# EAGLE design LED Controller 2011 (EAGLE 5.11)
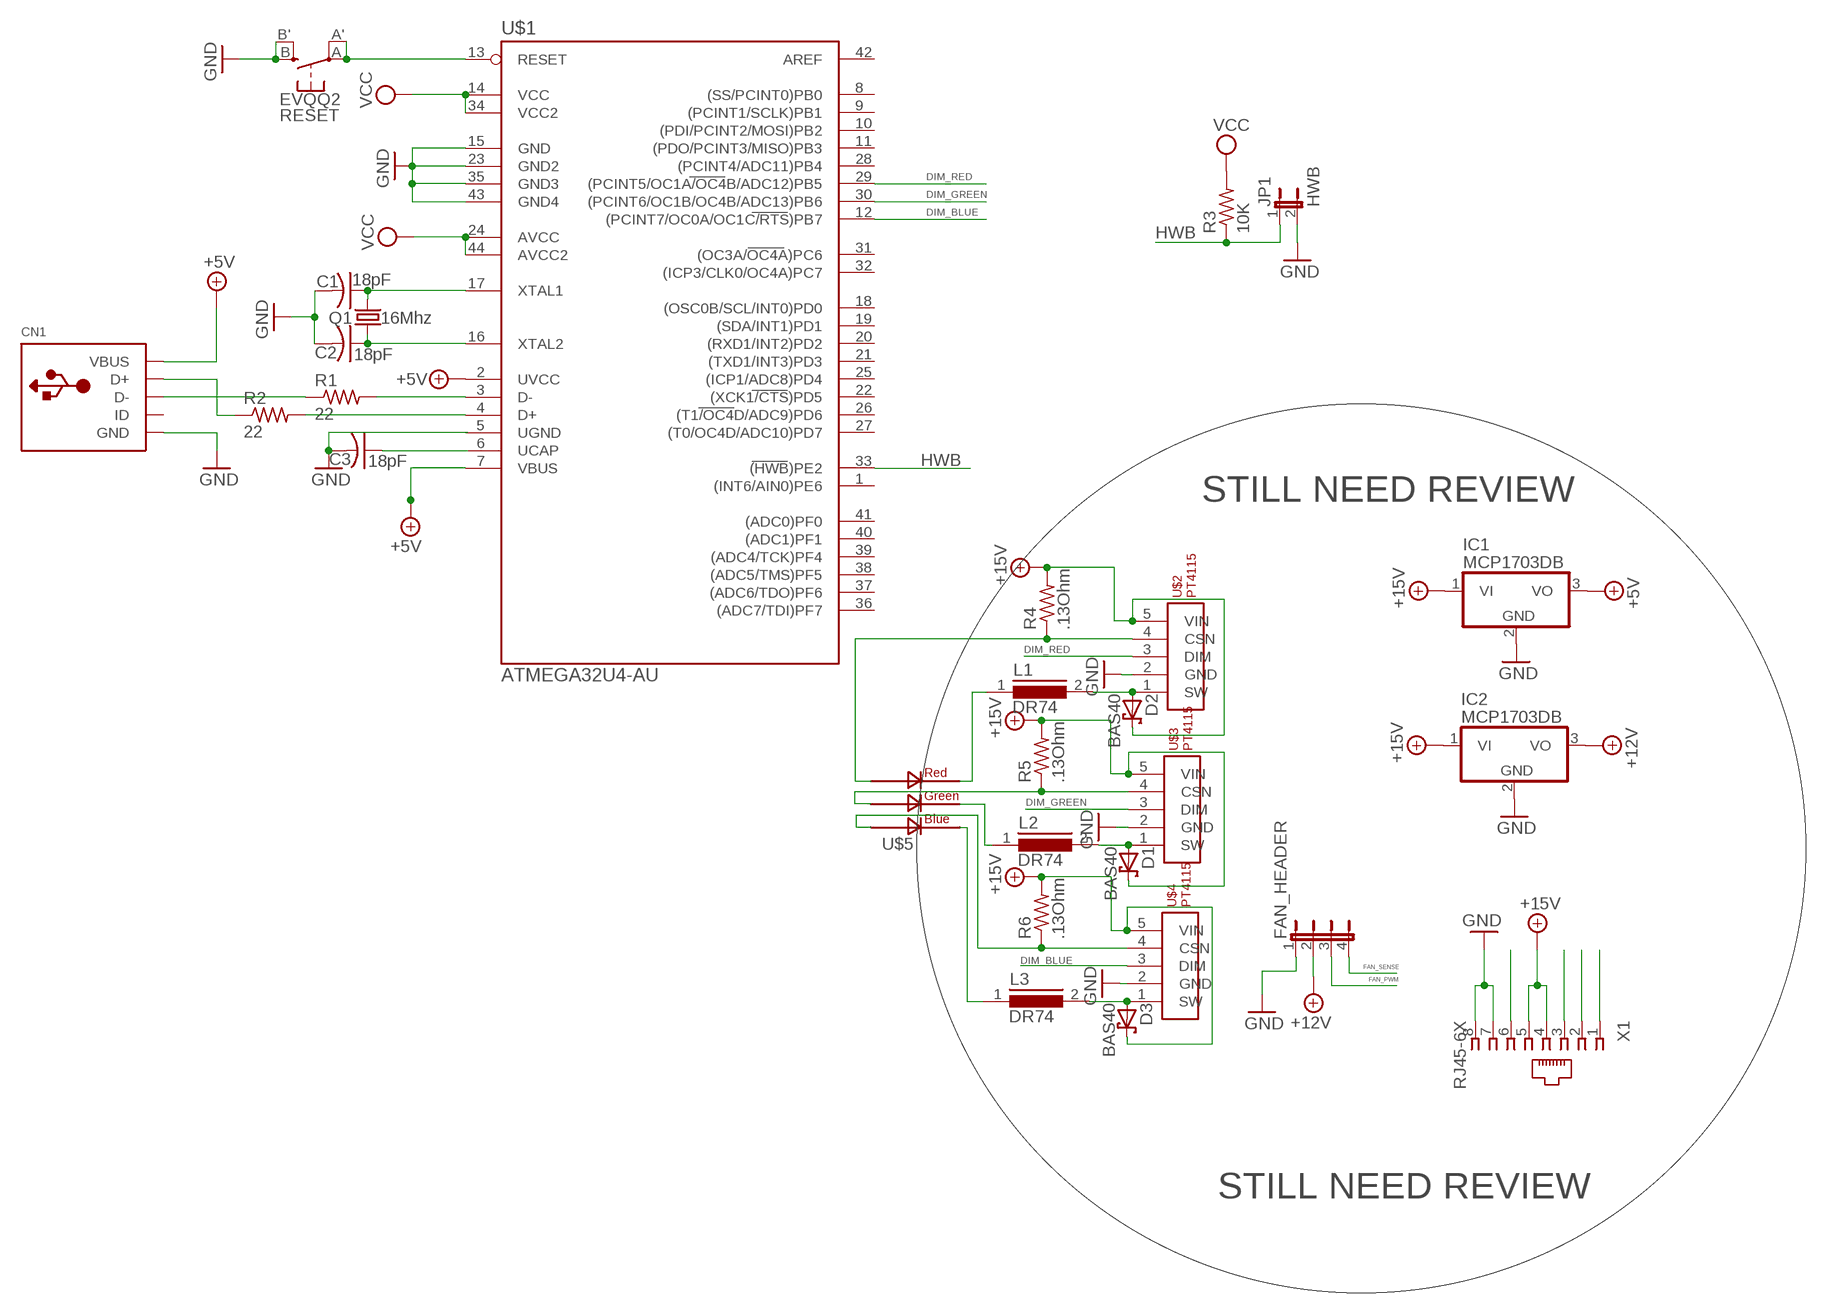
[diagram p0: schematic, sheet 1]

## Parts
C1  18pF  C-USC0805K  [C0805K]
C2  18pF  C-USC0805K  [C0805K]
C3  18pF  C-USC0805K  [C0805K]
CN1  USBMINIB  [USB-MINIB]
D1  BAS40  [SOT23]
D2  BAS40  [SOT23]
D3  BAS40  [SOT23]
FAN_HEADER  JP4E  [JP4]
IC1  MCP1703DB  [SOT223]
IC2  MCP1703DB  [SOT223]
JP1  HWB  JP1E  [JP1]
L1  DR74  [DR74]
L2  DR74  [DR74]
L3  DR74  [DR74]
Q1  16Mhz  CRYSTALHC49S  [HC49/S]
R1  22  R-US_R0805  [R0805]
R2  22  R-US_R0805  [R0805]
R3  10K  R-US_R0805  [R0805]
R4  .13Ohm  R-US_R0805  [R0805]
R5  .13Ohm  R-US_R0805  [R0805]
R6  .13Ohm  R-US_R0805  [R0805]
RESET  EVQQ2  [EVQ-Q2]
U$1  ATMEGA32U4-AU  [TQFP44]
U$2  PT4115  [SOT89-5]
U$3  PT4115  [SOT89-5]
U$4  PT4115  [SOT89-5]
U$5  10W_RGB_LED  [10W_RGB_LED]
X1  RJ45-6X  [RJ45-NO-SHIELD]

## Nets
+5V: CN1.VBUS IC1.3(VO) U$1.2(UVCC) U$1.7(VBUS)
+12V: FAN_HEADER.2 IC2.3(VO)
+15V: D1.3(C) D2.3(C) D3.3(C) IC1.1(VI) IC2.1(VI) R4.2 R5.2 R6.2 U$2.5(VIN) U$3.5(VIN) U$4.5(VIN) X1.4 X1.5
DIM_BLUE: U$1.12((PCINT7/OC0A/OC1C/RTS)PB7) U$4.3(DIM)
DIM_GREEN: U$1.30((PCINT6/OC1B/OC4B/ADC13)PB6) U$3.3(DIM)
DIM_RED: U$1.29((PCINT5/OC1A/OC4B/ADC12)PB5) U$2.3(DIM)
FAN_PWM: FAN_HEADER.4
GND: C1.2 C2.2 C3.2 CN1.GND IC1.2(GND) IC2.2(GND) JP1.2 RESET.B'(S1) RESET.B(S) U$1.15(GND) U$1.23(GND2) U$1.35(GND3) U$1.43(GND4) U$2.2(GND) U$3.2(GND) U$4.2(GND) X1.7 X1.8
HWB: JP1.1 R3.1 U$1.33((HWB)PE2)
N$1: CN1.D- R1.1
N$2: FAN_HEADER.1 ; supply symbol labelled GND
N$3: R2.2 U$1.4(D+)
N$4: R1.2 U$1.3(D-)
N$5: C3.1
N$6: X1.6
N$7: CN1.D+ R2.1
N$8: C1.1 Q1.2 U$1.17(XTAL1)
N$9: RESET.A'(P1) RESET.A(P) U$1.13(RESET)
N$10: C2.1 Q1.1 U$1.16(XTAL2)
N$11: FAN_HEADER.3
N$12: X1.3
N$13: X1.2
N$14: X1.1
N$15: R4.1 U$2.4(CSN) U$5.R$2
N$16: L1.1 U$5.R$1
N$17: L2.1 U$5.G$1
N$18: R5.1 U$3.4(CSN) U$5.G$2
N$19: L3.1 U$5.B$1
N$20: R6.1 U$4.4(CSN) U$5.B$2
N$21: D3.1(A) L3.2 U$4.1(SW)
N$22: D1.1(A) L2.2 U$3.1(SW)
N$23: D2.1(A) L1.2 U$2.1(SW)
VCC: R3.2 U$1.14(VCC) U$1.24(AVCC) U$1.34(VCC2) U$1.44(AVCC2)
Unconnected: CN1.ID U$1.1((INT6/AIN0)PE6) U$1.5(UGND) U$1.6(UCAP) U$1.8((SS/PCINT0)PB0) U$1.9((PCINT1/SCLK)PB1) U$1.10((PDI/PCINT2/MOSI)PB2) U$1.11((PDO/PCINT3/MISO)PB3) U$1.18((OSC0B/SCL/INT0)PD0) U$1.19((SDA/INT1)PD1) U$1.20((RXD1/INT2)PD2) U$1.21((TXD1/INT3)PD3) U$1.22((XCK1/CTS)PD5) U$1.25((ICP1/ADC8)PD4) U$1.26((T1/OC4D/ADC9)PD6) U$1.27((T0/OC4D/ADC10)PD7) U$1.28((PCINT4/ADC11)PB4) U$1.31((OC3A/OC4A)PC6) U$1.32((ICP3/CLK0/OC4A)PC7) U$1.36((ADC7/TDI)PF7) U$1.37((ADC6/TDO)PF6) U$1.38((ADC5/TMS)PF5) U$1.39((ADC4/TCK)PF4) U$1.40((ADC1)PF1) U$1.41((ADC0)PF0) U$1.42(AREF)

## Notes on the sheet
- DIM_RED
- DIM_GREEN
- DIM_BLUE
- STILL NEED REVIEW
- DIM_RED
- DIM_GREEN
- DIM_BLUE
- FAN_SENSE
- FAN_PWM
- STILL NEED REVIEW

## Library data of the parts
C1-C3 = adafruit:C-US: CAPACITOR, American symbol
CN1 = adafruit:USB: USB Connectors USBMINIB - Surface Mount Female Mini-B USB Connector 4UConnector: 06564 By microbuilder.eu Thru-hole RA Female Mini-B USB Connector 4UConnector: 18732 By ladyada.net
D1-D3 = diode:BAS40: Silicon Schottky Diodes General-purpose diode for high-speed switching
FAN_HEADER = jumper:JP4E: JUMPER
IC1 IC2 = linear:MCP1703: 250 mA, 16V, Low Quiescent Current LDO Regulator Source: http://ww1.microchip.com/downloads/en/DeviceDoc/22049b.pdf
JP1 = jumper:JP1E: JUMPER
L1-L3 = inductors:DR74: High Power Density, High Efficiency, Shielded Inductors Source: coiltronics_dr_series.pdf
Q1 = crystal:CRYSTAL: CRYSTAL; OC_FARNELL: 1667008; OC_NEWARK: unknown
R1-R6 = adafruit:R-US_: RESISTOR, American symbol
RESET = adafruit:EVQQ2: SMT 6mm switch, EVQQ2 series http://www.ladyada.net/library/eagle
U$1 = mega32U4:ATMEGA32U4-AU
U$2-U$4 = TechIsCool:PT4115
U$5 = TechIsCool:10W_RGB_LED
X1 = con-tycoelectronics:RJ45: CORCOM Modular RJ Jacks No Shield Source: www.tycoelectronics.com .. ENG_DS_1654001_1099_RJ_L_0507.pdf; MPN: RJ45-6X; OC_FARNELL: unknown; OC_NEWARK: 01P1604

## Board
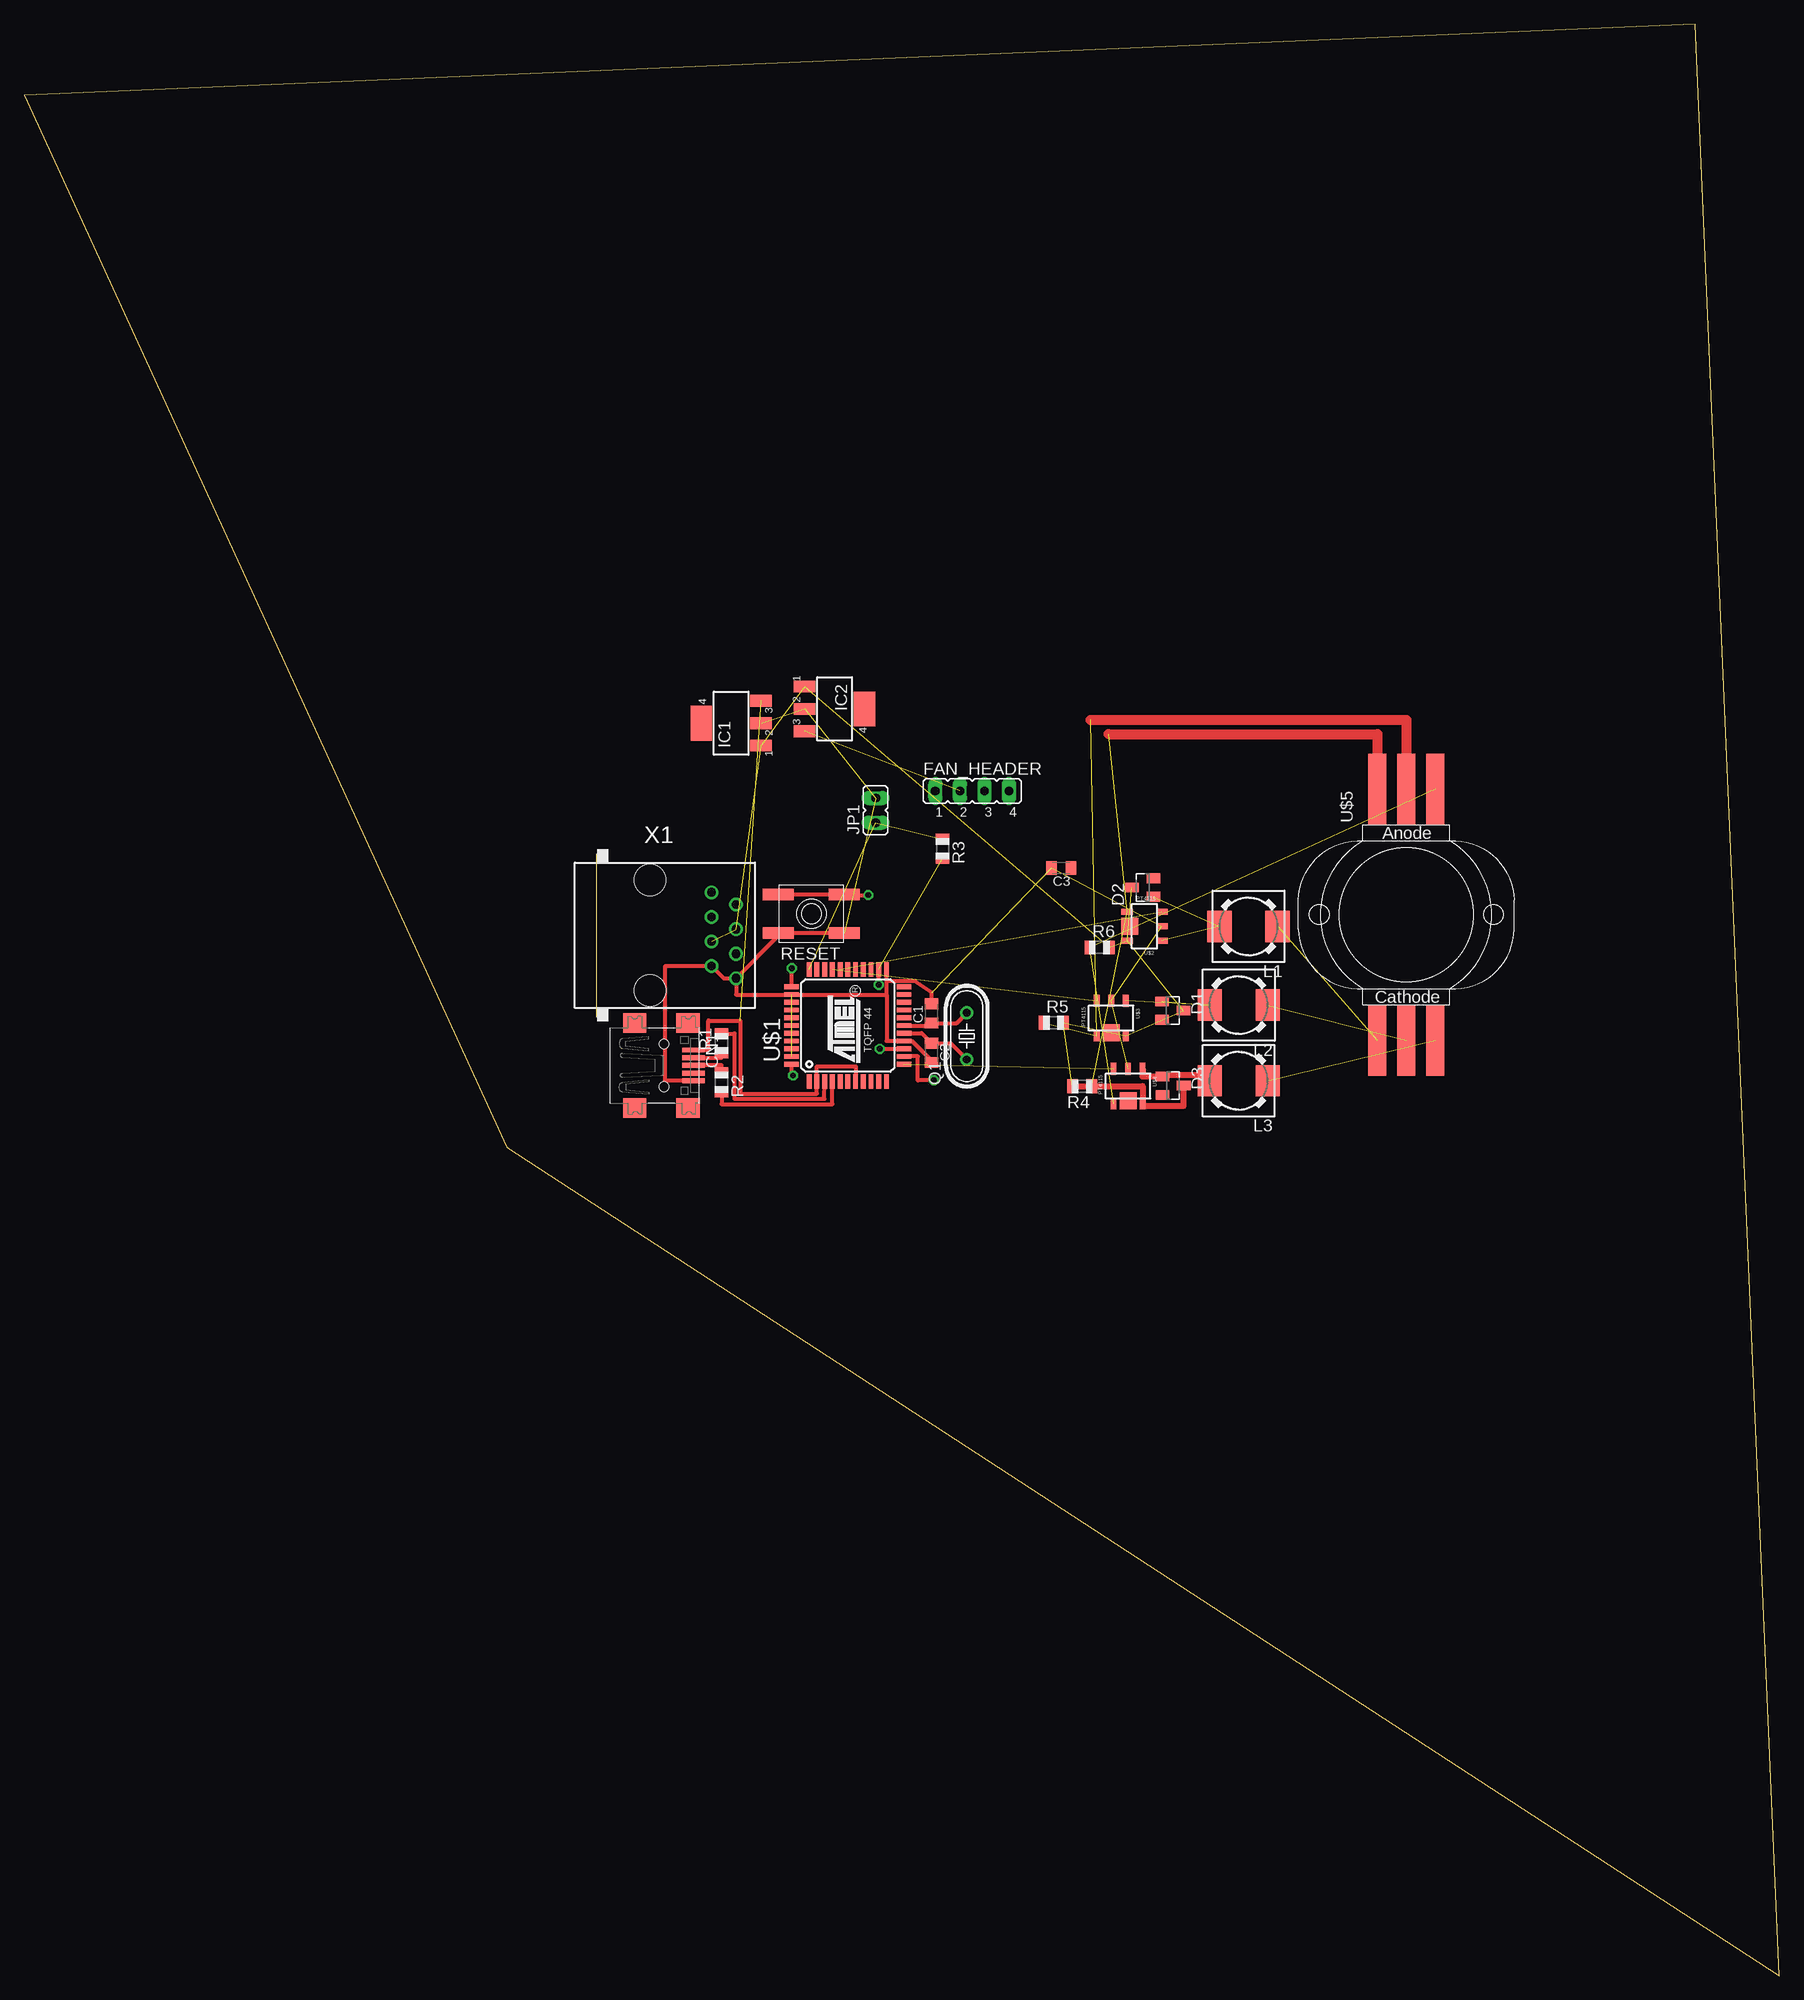
[diagram p1: board, top side]
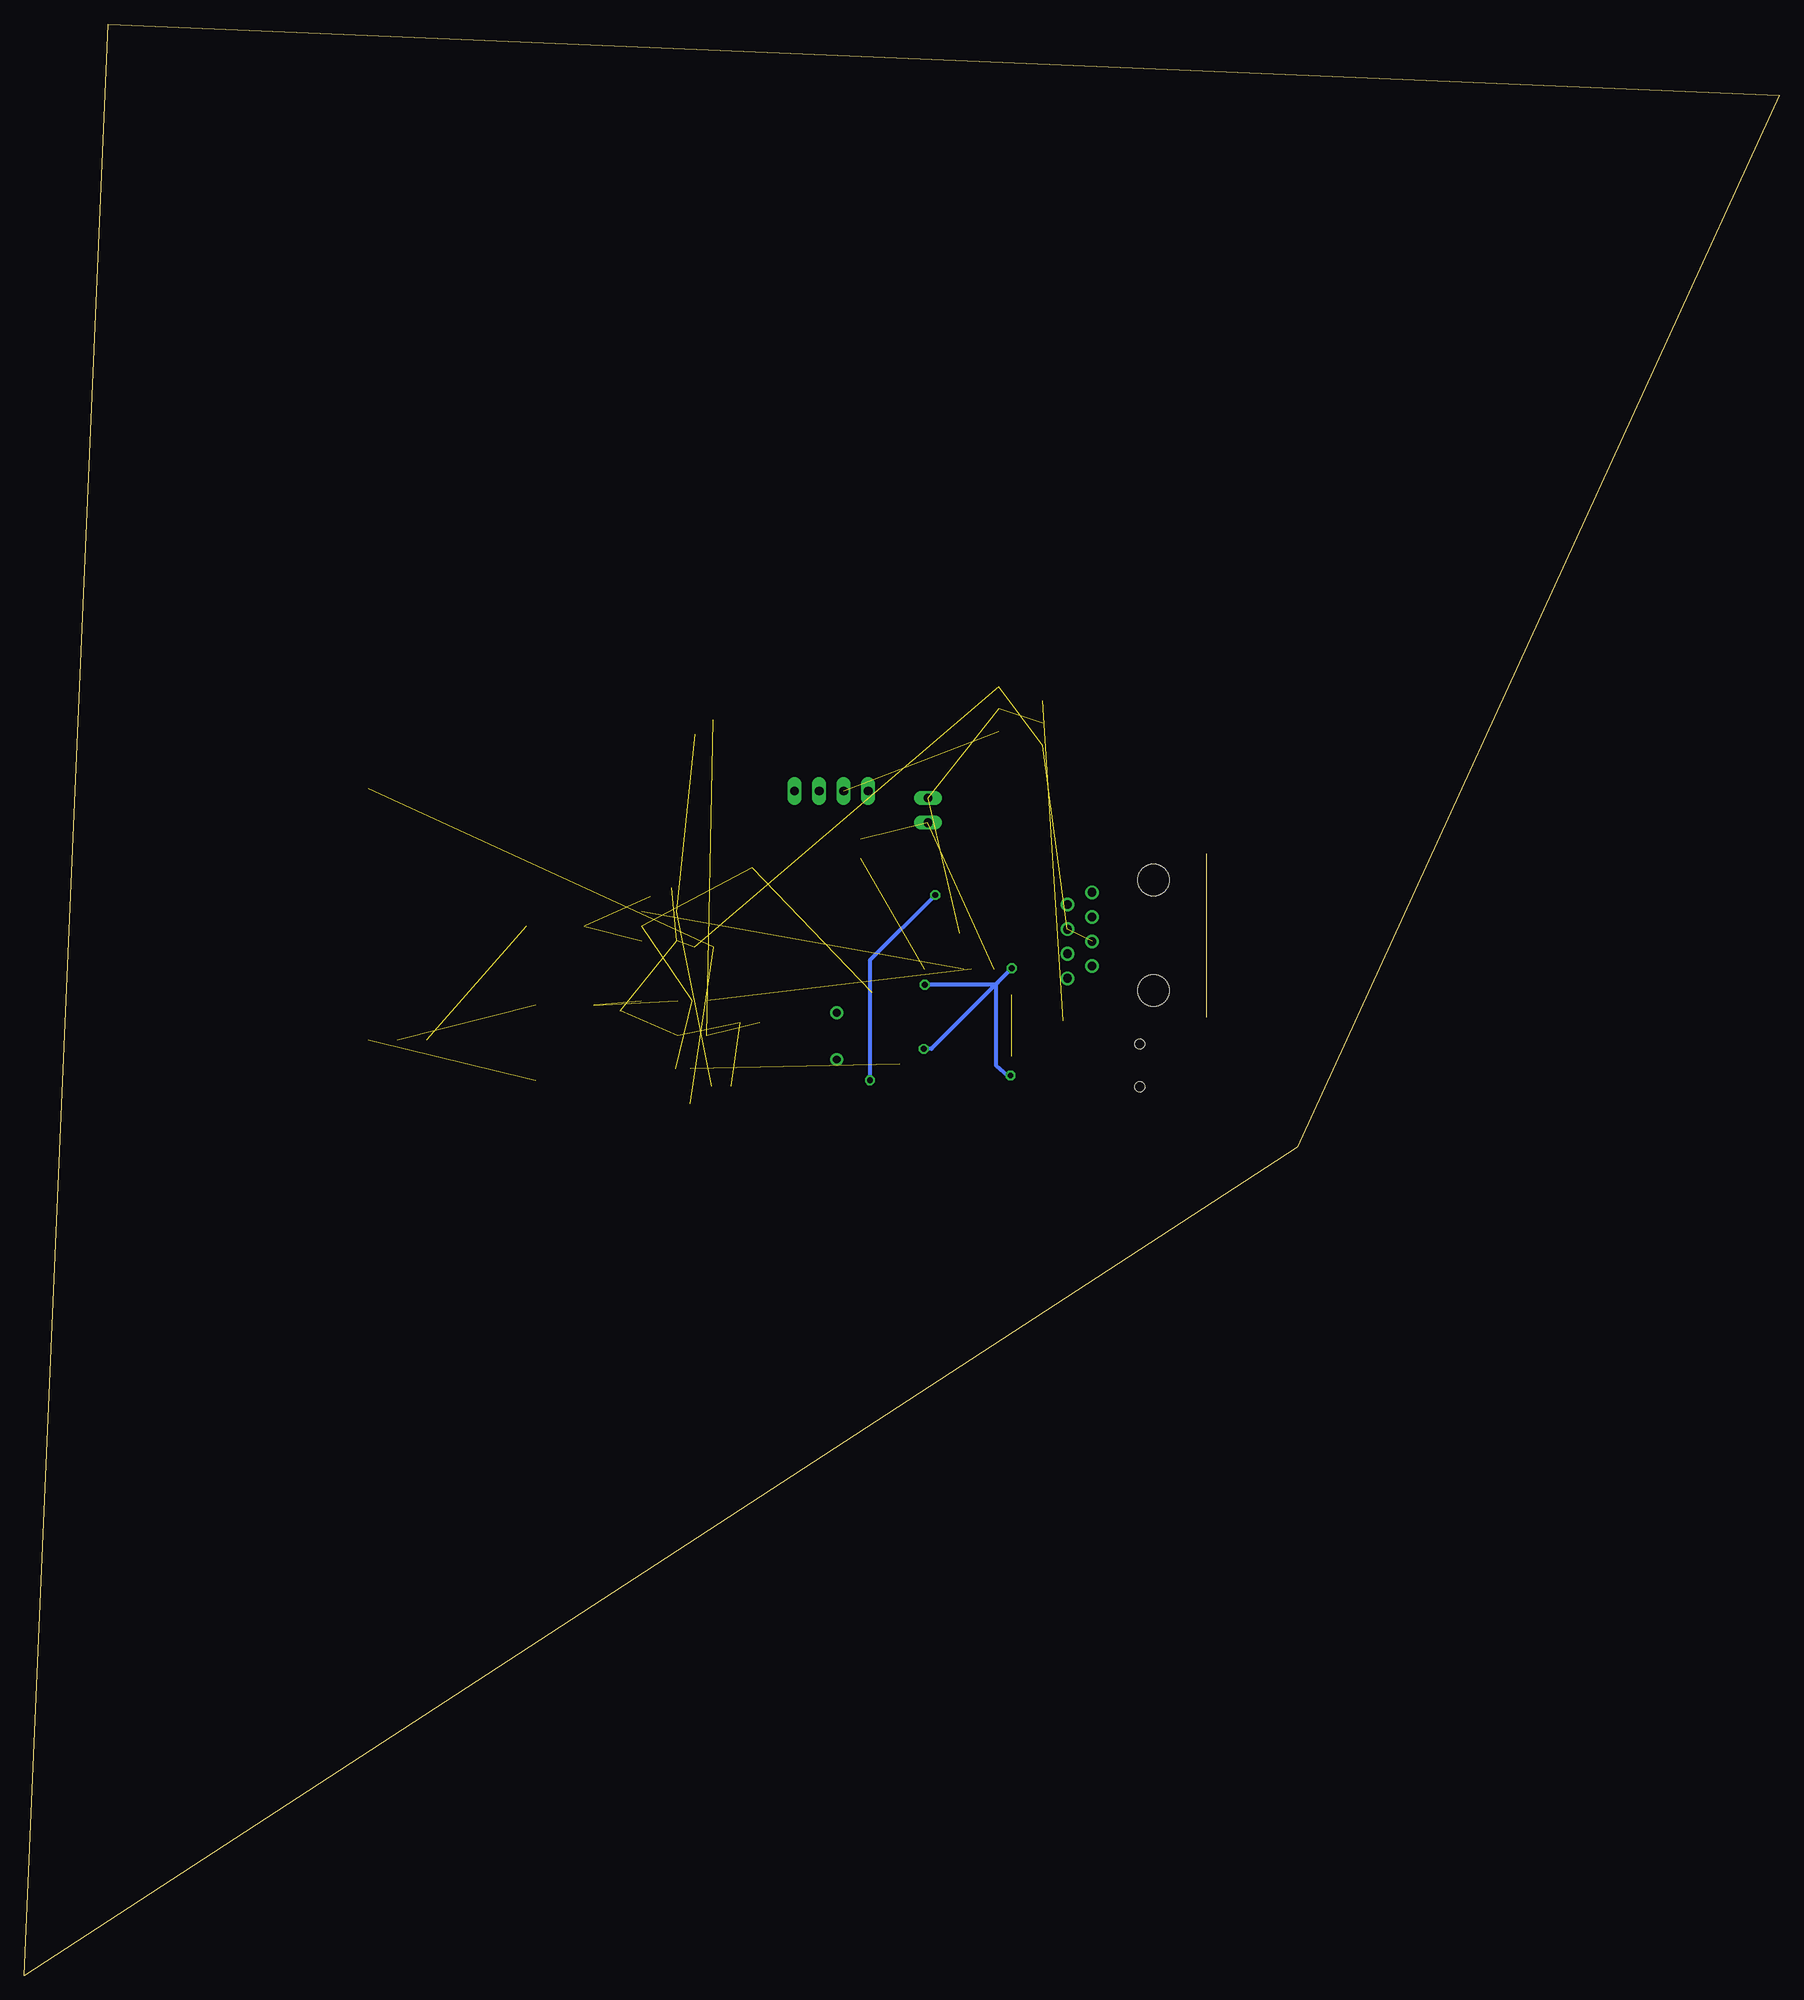
[diagram p2: board, bottom side, seen from below]

Size 181.46 x 201.76 mm. Coordinates in mm from the lower left corner, seen from the top.
Outline: 49.87,85.66 181.46,0 172.78,201.76 0,194.39 49.87,85.66
Copper layers (1*16): Top 0.035mm / dielectric 1.5mm / Bottom 0.035mm
Design rules: minimum track width 10mil, minimum drill 24mil, track to track 8mil, track to pad 8mil, pad to pad 8mil, via to via 8mil, smd to smd 8mil, copper to edge 40mil, drill to drill 8mil, minimum pad ring 10mil, minimum via ring 8mil, stop-mask expansion 4mil, vias tented up to drill 0mil, thermal gap 10mil

### Footprints (pad centres in the part's own frame; a part is rotated, then mirrored left to right if it is on the bottom)
C0805K = smd 1.1 x 1.4: 1 -1,0; 2 1,0
USB-MINIB = smd 0.5 x 2.308: D+ 0,4.064; D- -0.8,4.064; GND 1.6,4.064; ID 0.8,4.064; VBUS -1.6,4.064 | smd 2 x 2.4: GND1 -4.4,-2; GND2 -4.4,3.5; GND3 4.4,3.5; GND4 4.4,-2 | hole 1: -2.2,1; 2.2,1
SOT23 = smd 1 x 1.4: 1 -0.95,-1.1; 2 0.95,-1.1; 3 0,1.1
JP4 = drill 0.914 long: 1 -3.81,0; 2 -1.27,0; 3 1.27,0; 4 3.81,0
SOT223 = smd 1.219 x 2.235: 1 -2.311,-3.099; 2 0,-3.099; 3 2.311,-3.099 | smd 3.6 x 2.2: 4 0,3.099
JP1 = drill 0.914 long: 1 0,-1.27; 2 0,1.27
DR74 = smd 2.5 x 3.25: 1 -3,0; 2 3,0
HC49/S = drill 0.813: 1 -2.413,0; 2 2.413,0
R0805 = smd 1.1 x 1.4: 1 -1,0; 2 1,0
EVQ-Q2 = smd 3.2 x 1.2: A -3.4,-2; A' 3.4,-2; B -3.4,2; B' 3.4,2
TQFP44 = smd 1.5 x 0.5: 1 -5.8,4; 2 -5.8,3.2; 3 -5.8,2.4; 4 -5.8,1.6; 5 -5.8,0.8; 6 -5.8,0; 7 -5.8,-0.8; 8 -5.8,-1.6; 9 -5.8,-2.4; 10 -5.8,-3.2; 11 -5.8,-4; 23 5.8,-4; 24 5.8,-3.2; 25 5.8,-2.4; 26 5.8,-1.6; 27 5.8,-0.8; 28 5.8,0; 29 5.8,0.8; 30 5.8,1.6; 31 5.8,2.4; 32 5.8,3.2; 33 5.8,4 | smd 0.5 x 1.5: 12 -4,-5.8; 13 -3.2,-5.8; 14 -2.4,-5.8; 15 -1.6,-5.8; 16 -0.8,-5.8; 17 0,-5.8; 18 0.8,-5.8; 19 1.6,-5.8; 20 2.4,-5.8; 21 3.2,-5.8; 22 4,-5.8; 34 4,5.8; 35 3.2,5.8; 36 2.4,5.8; 37 1.6,5.8; 38 0.8,5.8; 39 0,5.8; 40 -0.8,5.8; 41 -1.6,5.8; 42 -2.4,5.8; 43 -3.2,5.8; 44 -4,5.8
SOT89-5 = smd 0.58 x 1.2: 1 -1.5,-1.8; 2 0,-1.8; 3 1.5,-1.8; 4 1.5,1.8; 5 -1.5,1.8 | smd 1.75 x 1.75: NC 0,1.525
10W_RGB_LED = smd 7.3 x 1.85: B$1 -13,-3; B$2 13,-3; G$1 -13,0; G$2 13,0; R$1 -13,3; R$2 13,3
RJ45-NO-SHIELD = drill 0.9 pad 1.4: 1 -4.445,6.35; 2 -3.175,8.89; 3 -1.905,6.35; 4 -0.635,8.89; 5 0.635,6.35; 6 1.905,8.89; 7 3.175,6.35; 8 4.445,8.89 | hole 3.251: -5.715,0; 5.715,0

### Placement (x,y rotation side)
C1  93.8,99.5 90 top
C2  93.8,95.41 270 top
C3  107.2,114.54 180 top
CN1  65.13,94.12 270 top
D1  118.75,99.78 270 top
D2  115.63,112.51 90 top
D3  118.77,92.02 270 top
FAN_HEADER  98.01,122.49 0 top
IC1  73.08,129.5 90 top
IC2  83.78,130.97 270 top
JP1  88.02,120.49 0 top
L1  126.57,108.48 180 top
L2  125.56,100.34 180 top
L3  125.55,92.53 180 top
Q1  97.45,97.14 90 top
R1  72.09,96.41 90 top
R2  72.1,92.37 270 top
R3  94.95,116.51 270 top
R4  109.37,91.96 180 top
R5  106.42,98.53 0 top
R6  111.17,106.33 0 top
RESET  81.38,109.8 180 top
U$1  85.15,98.24 90 top
U$2  115.82,108.5 90 top
U$3  112.38,99 180 top
U$4  114.12,91.98 180 top
U$5  142.88,109.7 90 top
X1  64.71,107.57 270 top

### Tracks (layer width: path | path; a pad name or v marks a point on that pad's centre or on a via)
+5V  (1 unrouted)
  Top 0.406: CN1.VBUS 70.73,95.72 70.73,98.75 74.02,98.75 74.02,91.2 81.95,91.2 U$1.2 81.95,94.02 85.94,94.02 U$1.7
+12V  (1 unrouted)
+15V  (10 unrouted)
  Top 0.61: D3.3 119.87,89.93 115.62,89.93 U$4.5 115.62,91.96 R4.2
DIM_BLUE  (1 unrouted)
DIM_GREEN  (1 unrouted)
DIM_RED  (1 unrouted)
GND  (8 unrouted)
  Top 0.406: CN1.GND 66.28,92.52 66.28,104.4 71.06,104.4 X1.7 72.33,103.12 X1.8 | X1.8 73.6,101.44 U$1.35 | U$1.35 89.15,101.44 89.15,102.83 | 89.15,102.83 U$1.23 | U$1.35 89.15,101.44 89.15,96.65 U$1.15 91.75,96.64 93.8,94.59 C2.2 | C1.2 93.8,101.61 92.06,102.84 89.16,102.84 89.15,102.83 | X1.8 77.98,107.5 RESET.B' RESET.B
HWB  (2 unrouted)
N$1
  Top 0.406: CN1.D- 72.09,94.92 R1.1
N$3
  Top 0.406: R2.2 72.1,90.11 83.55,90.11 U$1.4
N$4
  Top 0.406: R1.2 73.42,97.41 73.42,90.67 82.73,90.66 U$1.3
N$7
  Top 0.406: R2.1 72.1,94.12 CN1.D+
N$8
  Top 0.406: U$1.17 93.55,98.24 C1.1 96.39,98.5 Q1.2
N$9  (via drill 0.6)
  Top 0.406: RESET.A' RESET.A 84.85,111.73 v87.28,111.73 | v94.03,92.58 92.4,92.58 92.4,95.05 U$1.13
  Bottom 0.406: v87.28,111.73 94.03,104.98 v94.03,92.58
N$10
  Top 0.406: U$1.16 92.77,97.44 C2.1 95.77,96.42 Q1.1
N$15  (2 unrouted)
  Top 0.406: U$5.R$2 140.15,122.7 140.15,123.82
  Top 1.016: 112.11,128.36 139.88,128.36 U$5.R$2
N$16  (1 unrouted)
N$17  (1 unrouted)
N$18  (2 unrouted)
  Top 1.016: 110.24,129.83 142.89,129.83 U$5.G$2
N$19  (1 unrouted)
N$20  (2 unrouted)
N$21
  Top 0.61: 117.69,93.17 D3.1 115.62,92.97 U$4.1 | 117.69,93.17 122.57,93.17 | 122.57,93.17 L3.2 | L3.2 | 117.69,93.17 122.57,93.17
N$22  (2 unrouted)
N$23  (2 unrouted)
VCC  (via drill 0.6)  (1 unrouted)
  Top 0.406: U$1.34 v79.35,104.15 | v79.49,93.07 79.35,93.22 U$1.44 | v88.45,95.83 90.93,95.83 arc90 U$1.14 | v88.34,102.46 arc90 v88.35,102.47 U$1.24
  Bottom 0.406: v79.35,104.15 80.86,102.65 | 81,102.45 81,94.13 79.79,93.07 v79.49,93.07 | 80.86,102.65 87.68,95.83 v88.45,95.83 | 80.86,102.65 81,102.45 | 81,102.45 v88.34,102.46